# Altium schematic sheet ADS1298.SchDoc
size A4
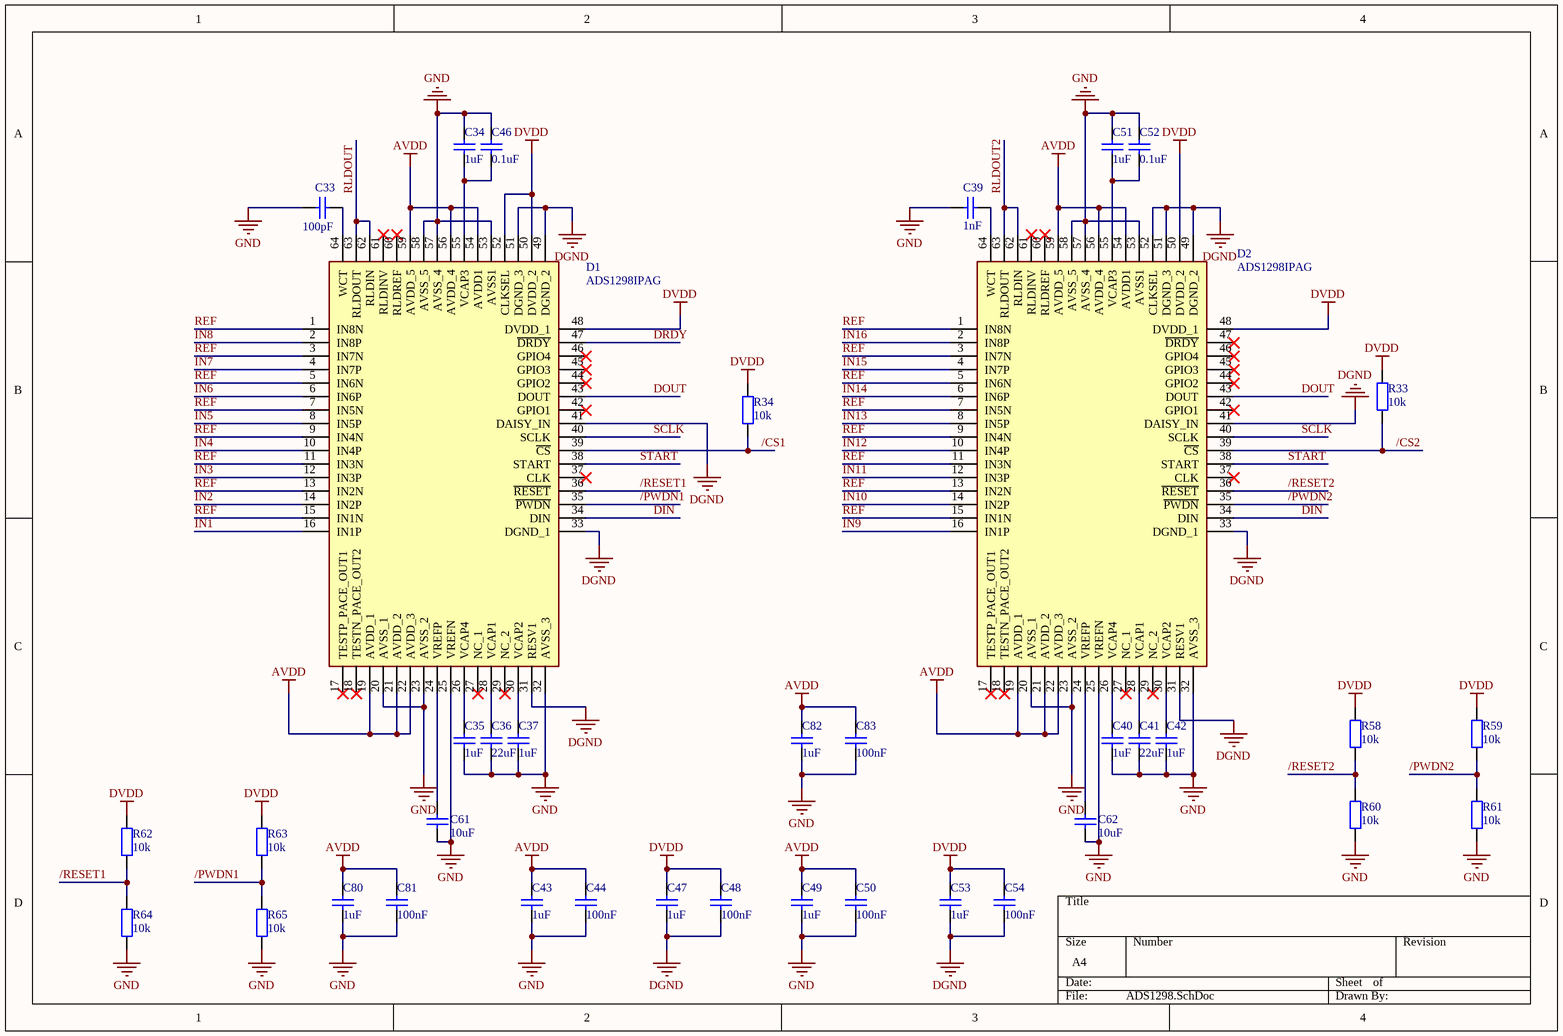
[diagram p0: ADS1298.SchDoc]

## Parts
C33  100pF  [C0603]
C34  1uF  [C0603]
C35  1uF  [C0603]
C36  22uF  [C0603]
C37  1uF  [C0603]
C39  1nF  [C0603]
C40  1uF  [C0603]
C41  22uF  [C0603]
C42  1uF  [C0603]
C43  1uF  [C0603]
C44  100nF  [C0603]
C46  0.1uF  [C0603]
C47  1uF  [C0603]
C48  100nF  [C0603]
C49  1uF  [C0603]
C50  100nF  [C0603]
C51  1uF  [C0603]
C52  0.1uF  [C0603]
C53  1uF  [C0603]
C54  100nF  [C0603]
C61  10uF  [C0603]
C62  10uF  [C0603]
C80  1uF  [C0603]
C81  100nF  [C0603]
C82  1uF  [C0603]
C83  100nF  [C0603]
D1  ADS1298IPAG  [ADS1298]
D2  ADS1298IPAG  [ADS1298]
R33  10k  [RES0603]
R34  10k  [RES0603]
R58  10k  [RES0603]
R59  10k  [RES0603]
R60  10k  [RES0603]
R61  10k  [RES0603]
R62  10k  [RES0603]
R63  10k  [RES0603]
R64  10k  [RES0603]
R65  10k  [RES0603]

## Nets
AVDD: C43.1 C44.1 C49.1 C50.1 C80.1 C81.1 C82.1 C83.1 D1.19(AVDD_1) D1.21(AVDD_2) D1.22(AVDD_3) D1.54(AVDD1) D1.56(AVDD_4) D1.59(AVDD_5) D2.19(AVDD_1) D2.21(AVDD_2) D2.22(AVDD_3) D2.54(AVDD1) D2.56(AVDD_4) D2.59(AVDD_5)
DGND: C47.2 C48.2 C53.2 C54.2 D1.31(RESV1) D1.33(DGND_1) D1.41(DAISY_IN) D1.49(DGND_2) D1.51(DGND_3) D2.31(RESV1) D2.33(DGND_1) D2.41(DAISY_IN) D2.49(DGND_2) D2.51(DGND_3) D2.52(CLKSEL)
DVDD: C47.1 C48.1 C53.1 C54.1 D1.48(DVDD_1) D1.50(DVDD_2) D1.52(CLKSEL) D2.48(DVDD_1) D2.50(DVDD_2) R33.2 R34.2 R58.2 R59.2 R62.2 R63.2
GND: C33.2 C34.2 C35.2 C36.2 C37.2 C39.2 C40.2 C41.2 C42.2 C43.2 C44.2 C46.2 C49.2 C50.2 C51.2 C52.2 C61.1 C62.1 C80.2 C81.2 C82.2 C83.2 D1.20(AVSS_1) D1.23(AVSS_2) D1.25(VREFN) D1.32(AVSS_3) D1.53(AVSS1) D1.57(AVSS_4) D1.58(AVSS_5) D2.20(AVSS_1) D2.23(AVSS_2) D2.25(VREFN) D2.32(AVSS_3) D2.53(AVSS1) D2.57(AVSS_4) D2.58(AVSS_5) R60.1 R61.1 R64.1 R65.1
/CS1: D1.39(~{CS}) R34.1
/CS2: D2.39(~{CS}) R33.1
/PWDN1: D1.35(~{PWDN}) R63.1 R65.2
/PWDN2: D2.35(~{PWDN}) R59.1 R61.2
/RESET1: D1.36(~{RESET}) R62.1 R64.2
/RESET2: D2.36(~{RESET}) R58.1 R60.2
DIN: D1.34(DIN) D2.34(DIN)
DOUT: D1.43(DOUT) D2.43(DOUT)
DRDY: D1.47(~{DRDY})
IN1: D1.16(IN1P)
IN2: D1.14(IN2P)
IN3: D1.12(IN3P)
IN4: D1.10(IN4P)
IN5: D1.8(IN5P)
IN6: D1.6(IN6P)
IN7: D1.4(IN7P)
IN8: D1.2(IN8P)
IN9: D2.16(IN1P)
IN10: D2.14(IN2P)
IN11: D2.12(IN3P)
IN12: D2.10(IN4P)
IN13: D2.8(IN5P)
IN14: D2.6(IN6P)
IN15: D2.4(IN7P)
IN16: D2.2(IN8P)
REF: D1.1(IN8N) D1.3(IN7N) D1.5(IN6N) D1.7(IN5N) D1.9(IN4N) D1.11(IN3N) D1.13(IN2N) D1.15(IN1N) D2.1(IN8N) D2.3(IN7N) D2.5(IN6N) D2.7(IN5N) D2.9(IN4N) D2.11(IN3N) D2.13(IN2N) D2.15(IN1N)
RLDOUT: D1.62(RLDIN) D1.63(RLDOUT)
RLDOUT2: D2.62(RLDIN) D2.63(RLDOUT)
SCLK: D1.40(SCLK) D2.40(SCLK)
START: D1.38(START) D2.38(START)
NetC33_1: C33.1 D1.64(WCT)
NetC34_1: C34.1 C46.1 D1.55(VCAP3)
NetC35_1: C35.1 D1.26(VCAP4)
NetC36_1: C36.1 D1.28(VCAP1)
NetC37_1: C37.1 D1.30(VCAP2)
NetC39_1: C39.1 D2.64(WCT)
NetC40_1: C40.1 D2.26(VCAP4)
NetC41_1: C41.1 D2.28(VCAP1)
NetC42_1: C42.1 D2.30(VCAP2)
NetC51_1: C51.1 C52.1 D2.55(VCAP3)
NetC61_2: C61.2 D1.24(VREFP)
NetC62_2: C62.2 D2.24(VREFP)

Not connected (* = marked no-connect by the designer): D1 17(TESTP_PACE_OUT1)* 18(TESTN_PACE_OUT2)* 27(NC_1)* 29(NC_2)* 37(CLK)* 42(GPIO1)* 44(GPIO2)* 45(GPIO3)* 46(GPIO4)* 60(RLDREF)* 61(RLDINV)*; D2 17(TESTP_PACE_OUT1)* 18(TESTN_PACE_OUT2)* 27(NC_1)* 29(NC_2)* 37(CLK)* 42(GPIO1)* 44(GPIO2)* 45(GPIO3)* 46(GPIO4)* 47(~{DRDY})* 60(RLDREF)* 61(RLDINV)*

## Library data of the parts
C33 = Cap: Capacitor; Published: 8-Jun-2000; LatestRevisionDate: 17-Jul-2002; LatestRevisionNote: Re-released for DXP Platform.; PackageReference: RAD-0.3; Publisher: Altium Limited; PackageDescription: Radial Cap, Thru-Hole; 2 Leads; 0.3 in Pin Spacing; Value: 100pF
C34-C37 C39-C44 C46-C54 C61 C62 C80-C83 = Cap: Capacitor; Value: 100pF; Published: 8-Jun-2000; LatestRevisionDate: 17-Jul-2002; LatestRevisionNote: Re-released for DXP Platform.; PackageReference: RAD-0.3; Publisher: Altium Limited; PackageDescription: Radial Cap, Thru-Hole; 2 Leads; 0.3 in Pin Spacing
D1 D2 = ADS1298IPAG: Integrated Circuit; Manufacturer_Name: Texas Instruments; Datasheet Link: http://www.ti.com/lit/ds/symlink/ads1298.pdf; Height: 1.2mm; Manufacturer_Part_Number: ADS1298IPAG; Mouser Part Number: 595-ADS1298IPAG; Mouser Price/Stock: https://www.mouser.co.uk/ProductDetail/Texas-Instruments/ADS1298IPAG?qs=Z6FgPJT5dDR3VNlC6H4EKg%3D%3D; Arrow Part Number: ADS1298IPAG; Arrow Price/Stock: https://www.arrow.com/en/products/ads1298ipag/texas-instruments
R33 R34 R58-R65 = Res2: Resistor; Value: 1K; Published: 8-Jun-2000; LatestRevisionDate: 17-Jul-2002; LatestRevisionNote: Re-released for DXP Platform.; PackageReference: AXIAL-0.4; Publisher: Altium Limited; PackageDescription: Axial Device, Thru-Hole; 2 Leads; 0.4 in Pin Spacing